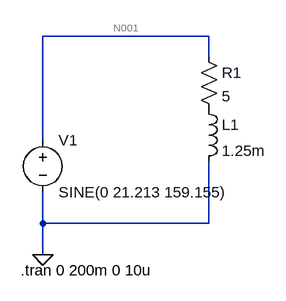
[diagram p0: schematic Схема4.asc]
Схема4.asc, the LTspice schematic file:
Version 4
SHEET 1 880 680
WIRE -1136 64 -1392 64
WIRE -1136 96 -1136 64
WIRE -1392 224 -1392 64
WIRE -1392 352 -1392 304
WIRE -1136 352 -1136 256
WIRE -1136 352 -1392 352
WIRE -1392 400 -1392 352
FLAG -1392 400 0
SYMBOL voltage -1392 208 R0
WINDOW 123 0 0 Left 0
WINDOW 39 0 0 Left 0
SYMATTR InstName V1
SYMATTR Value SINE(0 21.213 159.155)
SYMBOL res -1152 80 R0
SYMATTR InstName R1
SYMATTR Value 5
SYMBOL ind -1152 160 R0
SYMATTR InstName L1
SYMATTR Value 1.25m
TEXT -1426 424 Left 2 !.tran 0 200m 0 10u

The netlist it stands for:
* Схема4.asc
V1 N001 0 SINE(0 21.213 159.155)
R1 N001 P001 5
L1 P001 0 1.25m
.tran 0 200m 0 10u
.backanno
.end

* Results of the author's LTspice run, read from the files saved beside the schematic
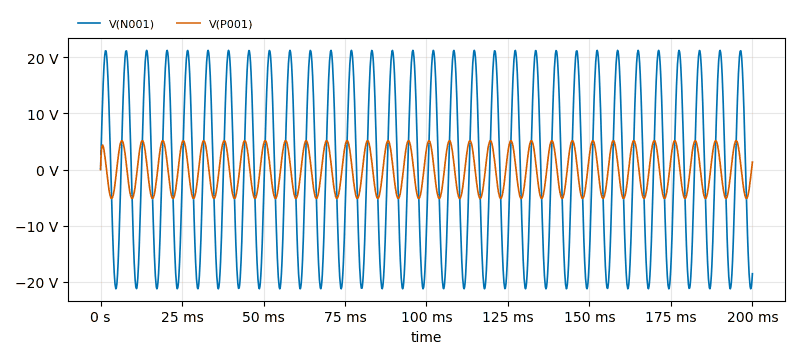
[diagram p1: Transient Analysis of Схема4.asc, plotted from the saved traces]
* Transient Analysis, 1 run:
*   V(N001): min -21.21 V, max 21.21 V, average 54.09 mV, rms 15 V, last -18.52 V
*   V(P001): min -5.144 V, max 5.144 V, average -24.86 mV, rms 3.633 V, last 1.338 V